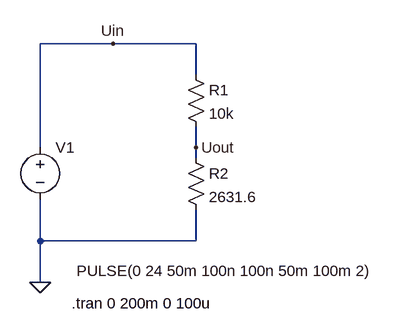
[diagram p0: schematic Draft2.asc]
Draft2.asc, the LTspice schematic file:
Version 4
SHEET 1 880 680
WIRE 48 -16 -64 -16
WIRE 176 -16 48 -16
WIRE 176 32 176 -16
WIRE -64 144 -64 -16
WIRE 176 144 176 112
WIRE 176 160 176 144
WIRE -64 288 -64 224
WIRE 176 288 176 240
WIRE 176 288 -64 288
WIRE -64 352 -64 288
FLAG -64 352 0
FLAG 176 144 Uout
FLAG 48 -16 Uin
SYMBOL res 160 16 R0
SYMATTR InstName R1
SYMATTR Value 10k
SYMBOL res 160 144 R0
SYMATTR InstName R2
SYMATTR Value 2631.6
SYMBOL voltage -64 128 R0
WINDOW 3 56 206 Left 2
WINDOW 123 0 0 Left 0
WINDOW 39 0 0 Left 0
SYMATTR InstName V1
SYMATTR Value PULSE(0 24 50m 100n 100n 50m 100m 2)
TEXT -16 384 Left 2 !.tran 0 200m 0 100u

The netlist it stands for:
* Draft2.asc
R1 Uin Uout 10k
R2 Uout 0 2631.6
V1 Uin 0 PULSE(0 24 50m 100n 100n 50m 100m 2)
.tran 0 200m 0 100u
.backanno
.end

* Results of the author's LTspice run, read from the files saved beside the schematic
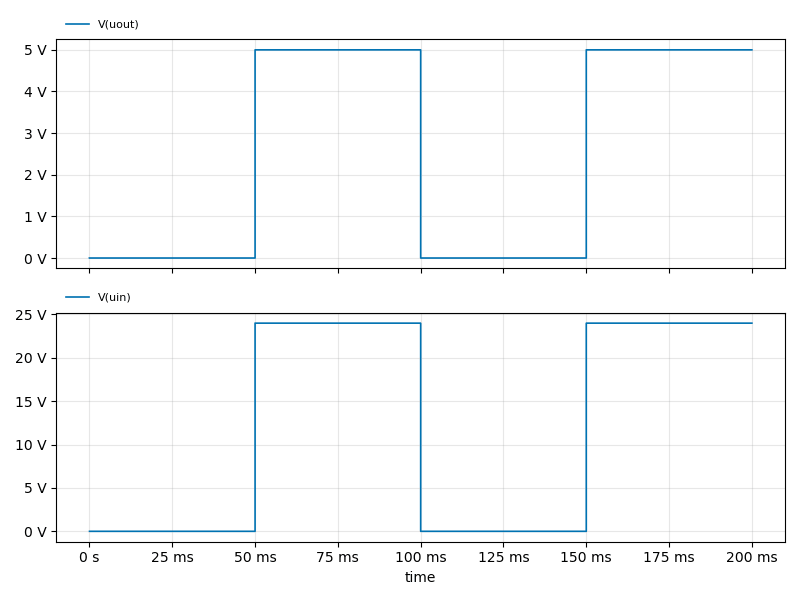
[diagram p1: Transient Analysis of Draft2.asc, plotted from the saved traces]
* Transient Analysis, 1 run:
*   V(uout): min 0 V, max 5 V, average 2.5 V, rms 3.536 V, last 5 V
*   V(uin): min 0 V, max 24 V, average 12 V, rms 16.97 V, last 24 V